# Altium project station_de_charge.PrjPcb
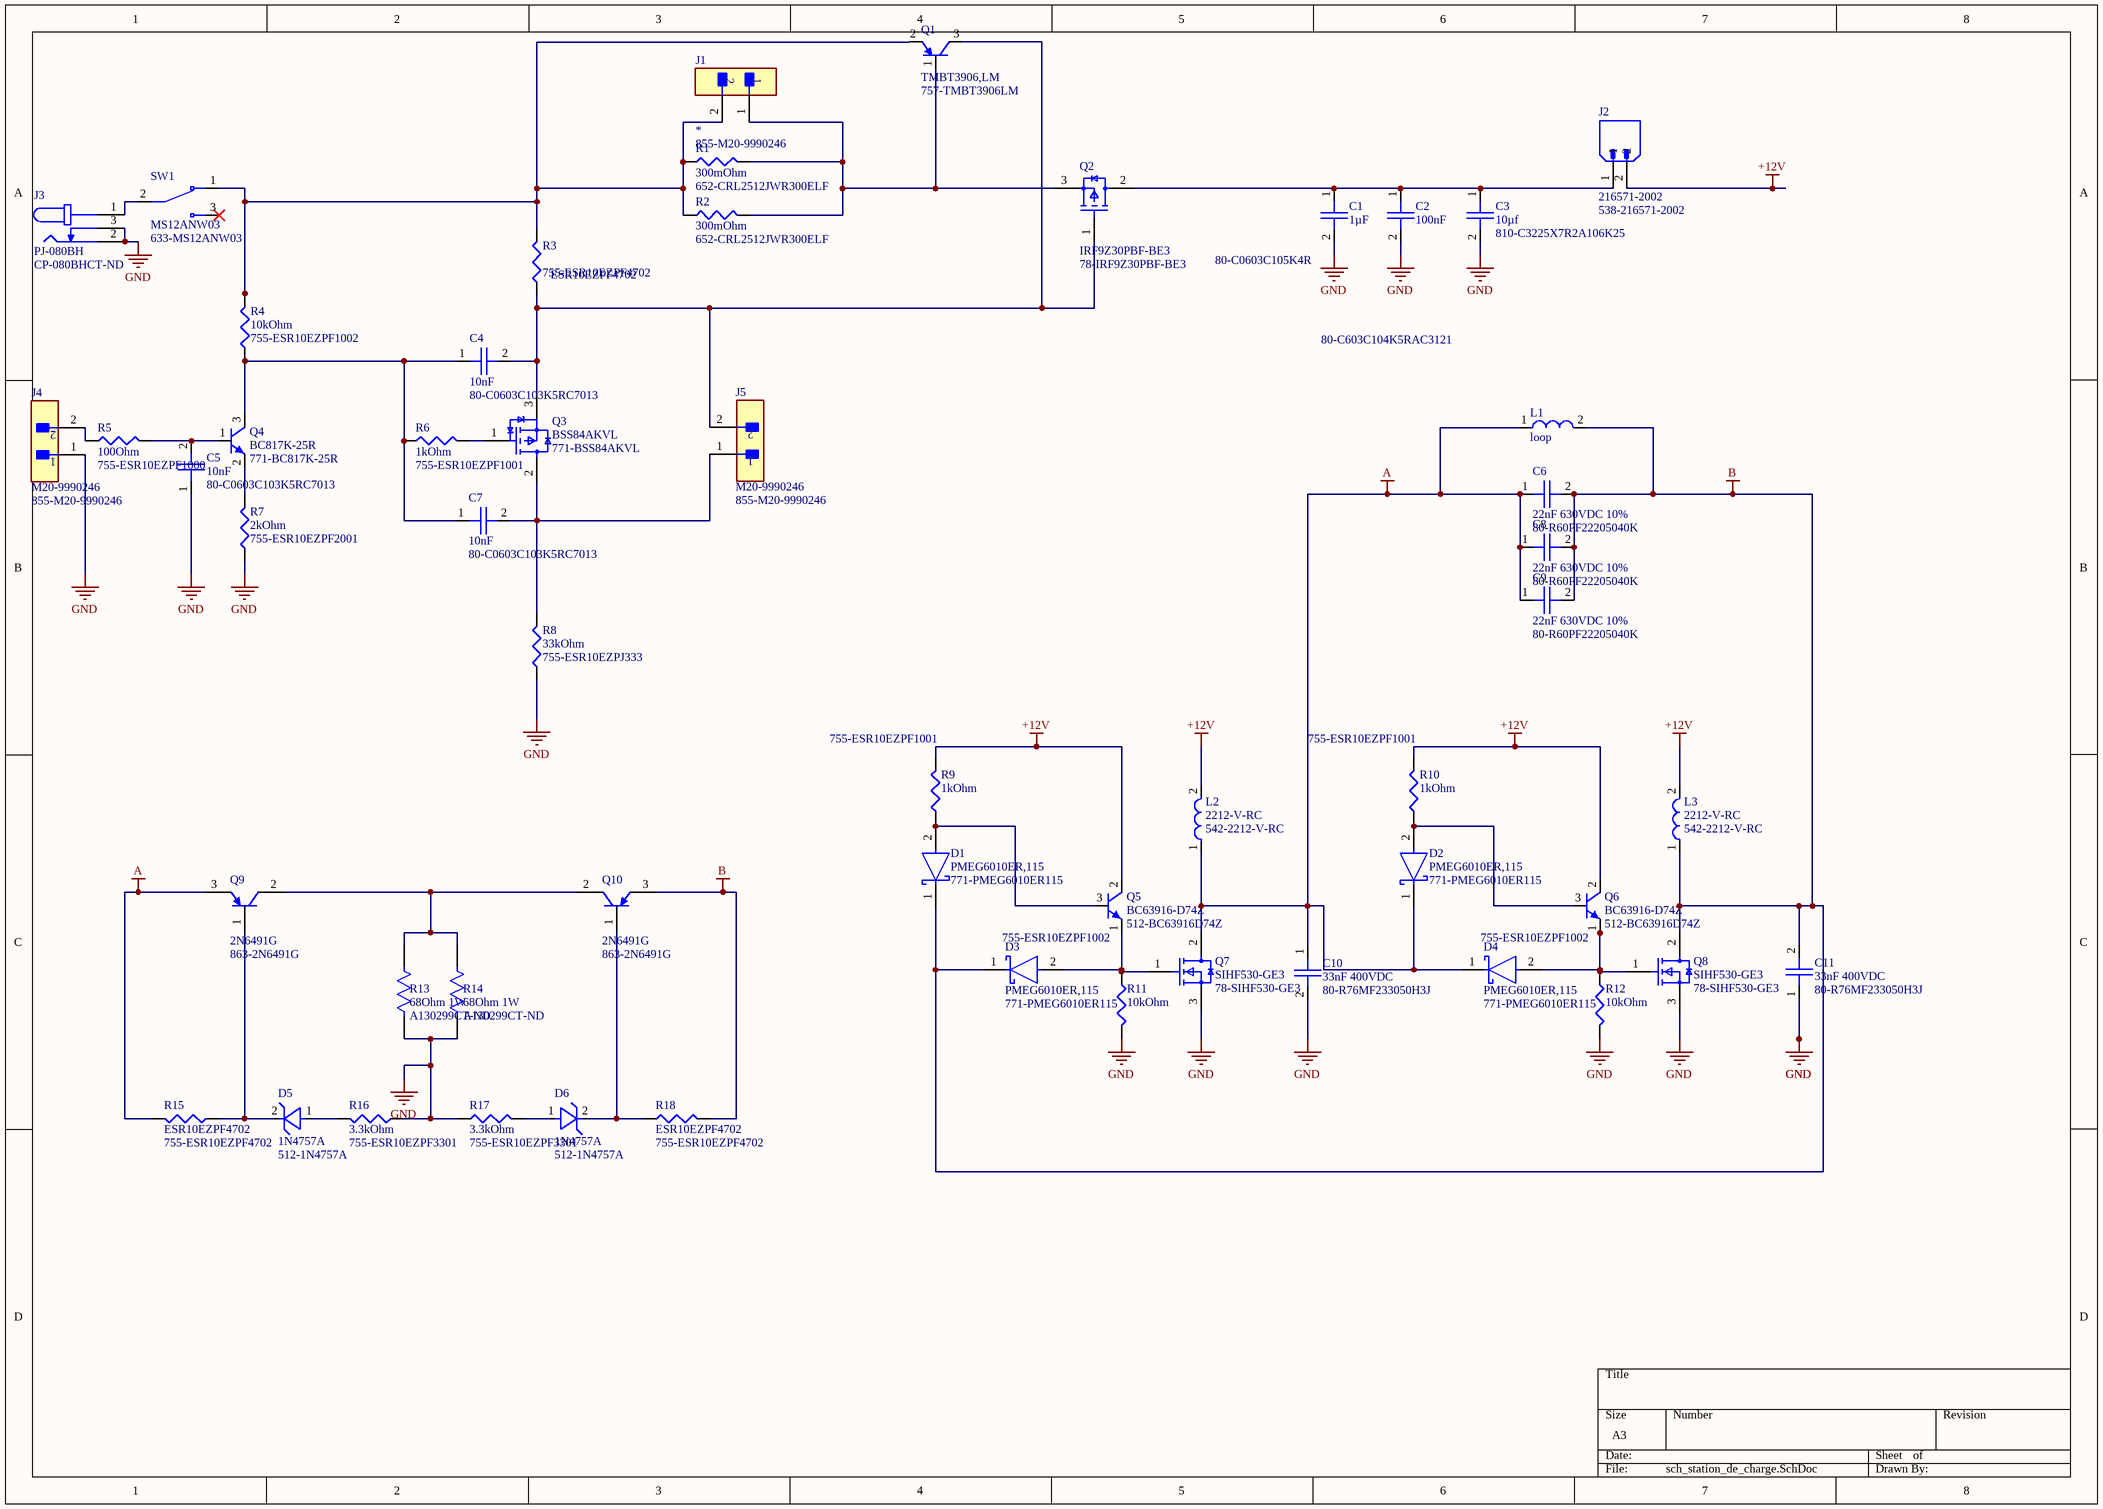
[diagram p0: sch_station_de_charge.SchDoc]
2 sheets, 65 parts. Net scope: global (net labels, ports and power ports of the same name join across sheets).
Board files: station_de_charge_PCB1.PcbDoc, station_de_charge_PCB1_r.PcbDoc
Sheets:
  sch_station_de_charge.SchDoc
  sch_station_de_charge_r.SchDoc

## Sheet sch_station_de_charge.SchDoc
size A3; SheetNumber: 1; SheetTotal: 2

### Parts
C1  1µF  Supplier Part Number 1: 80-C0603C105K4R  [CAPC1608X90X35NL15T15]
C2  100nF  Supplier Part Number 1: 80-C603C104K5RAC3121  [FP-C0603C104K5RAC3121-IPC_A]
C3  10µf  Supplier Part Number 1: 810-C3225X7R2A106K25  [CAPC3225X280N]
C4  10nF  Supplier Part Number 1: 80-C0603C103K5RC7013  [FP-C0603C104K5RAC3121-IPC_A]
C5  10nF  Supplier Part Number 1: 80-C0603C103K5RC7013  [FP-C0603C104K5RAC3121-IPC_A]
C6  22nF 630VDC 10%  Supplier Part Number 1: 80-R60PF22205040K  [R60PF22205040K]
C7  10nF  Supplier Part Number 1: 80-C0603C103K5RC7013  [FP-C0603C104K5RAC3121-IPC_A]
C8  22nF 630VDC 10%  Supplier Part Number 1: 80-R60PF22205040K  [R60PF22205040K]
C9  22nF 630VDC 10%  Supplier Part Number 1: 80-R60PF22205040K  [R60PF22205040K]
C10  33nF 400VDC  Supplier Part Number 1: 80-R76MF233050H3J  [R60PF22205040K]
C11  33nF 400VDC  Supplier Part Number 1: 80-R76MF233050H3J  [R60PF22205040K]
D1  PMEG6010ER,115  Supplier Part Number 1: 771-PMEG6010ER115  [TVS_PTVS13VS1UR,115]
D2  PMEG6010ER,115  Supplier Part Number 1: 771-PMEG6010ER115  [TVS_PTVS13VS1UR,115]
D3  PMEG6010ER,115  Supplier Part Number 1: 771-PMEG6010ER115  [TVS_PTVS13VS1UR,115]
D4  PMEG6010ER,115  Supplier Part Number 1: 771-PMEG6010ER115  [TVS_PTVS13VS1UR,115]
D5  1N4757A  Supplier Part Number 1: 512-1N4757A  [FAIR-DO-41-2_V]
D6  1N4757A  Supplier Part Number 1: 512-1N4757A  [FAIR-DO-41-2_V]
J1  *  Supplier Part Number 1: 855-M20-9990246  [FP-M20-9990246-MFG]
J2  216571-2002  Supplier Part Number 1: 538-216571-2002  [MOLEX_2165712002]
J3  PJ-080BH  Supplier Part Number 1: CP-080BHCT-ND  [CUI_PJ-080BH]
J4  M20-9990246  Supplier Part Number 1: 855-M20-9990246  [FP-M20-9990246-MFG]
J5  M20-9990246  Supplier Part Number 1: 855-M20-9990246  [FP-M20-9990246-MFG]
L1  loop  [loop]
L2  2212-V-RC  Supplier Part Number 1: 542-2212-V-RC  [IND_HCTI-220-5.8]
L3  2212-V-RC  Supplier Part Number 1: 542-2212-V-RC  [IND_HCTI-220-5.8]
Q1  TMBT3906,LM  Supplier Part Number 1: 757-TMBT3906LM  [FP-TMBT3906]
Q2  IRF9Z30PBF-BE3  Supplier Part Number 1: 78-IRF9Z30PBF-BE3  [TO-220AB-3-package]
Q3  BSS84AKVL  Supplier Part Number 1: 771-BSS84AKVL  [SOT95P230X110-3N]
Q4  BC817K-25R  Supplier Part Number 1: 771-BC817K-25R  [SOT95P230X110-3N]
Q5  BC63916-D74Z  Supplier Part Number 1: 512-BC63916D74Z  [TO92127P478H483-3]
Q6  BC63916-D74Z  Supplier Part Number 1: 512-BC63916D74Z  [TO92127P478H483-3]
Q7  SIHF530-GE3  Supplier Part Number 1: 78-SIHF530-GE3  [FP-SIHF530-GE3]
Q8  SIHF530-GE3  Supplier Part Number 1: 78-SIHF530-GE3  [FP-SIHF530-GE3]
Q9  2N6491G  Supplier Part Number 1: 863-2N6491G  [ONSC-TO-220-3-221A-09]
Q10  2N6491G  Supplier Part Number 1: 863-2N6491G  [ONSC-TO-220-3-221A-09]
R1  300mOhm  Supplier Part Number 1: 652-CRL2512JWR300ELF  [RESC6331X70N]
R2  300mOhm  Supplier Part Number 1: 652-CRL2512JWR300ELF  [RESC6331X70N]
R3  ESR10EZPF4702  Supplier Part Number 1: 755-ESR10EZPF4702  [FP-ESR10-IPC_A]
R4  10kOhm  Supplier Part Number 1: 755-ESR10EZPF1002  [FP-ESR10-IPC_A]
R5  100Ohm  Supplier Part Number 1: 755-ESR10EZPF1000  [FP-ESR10-IPC_A]
R6  1kOhm  Supplier Part Number 1: 755-ESR10EZPF1001  [FP-ESR10-IPC_A]
R7  2kOhm  Supplier Part Number 1: 755-ESR10EZPF2001  [FP-ESR10-IPC_A]
R8  33kOhm  Supplier Part Number 1: 755-ESR10EZPJ333  [FP-ESR10-IPC_A]
R9  1kOhm  Supplier Part Number 1: 755-ESR10EZPF1001  [FP-ESR10-IPC_A]
R10  1kOhm  Supplier Part Number 1: 755-ESR10EZPF1001  [FP-ESR10-IPC_A]
R11  10kOhm  Supplier Part Number 1: 755-ESR10EZPF1002  [FP-ESR10-IPC_A]
R12  10kOhm  Supplier Part Number 1: 755-ESR10EZPF1002  [FP-ESR10-IPC_A]
R13  68Ohm 1W  Supplier Part Number 1: A130299CT-ND  [FP-CRGCQ2512-IPC_A]
R14  68Ohm 1W  Supplier Part Number 1: A130299CT-ND  [FP-CRGCQ2512-IPC_A]
R15  ESR10EZPF4702  Supplier Part Number 1: 755-ESR10EZPF4702  [FP-ESR10-IPC_A]
R16  3.3kOhm  Supplier Part Number 1: 755-ESR10EZPF3301  [FP-ESR10-IPC_A]
R17  3.3kOhm  Supplier Part Number 1: 755-ESR10EZPF3301  [FP-ESR10-IPC_A]
R18  ESR10EZPF4702  Supplier Part Number 1: 755-ESR10EZPF4702  [FP-ESR10-IPC_A]
SW1  MS12ANW03  Supplier Part Number 1: 633-MS12ANW03  [SW_MS12ANW03]

### Nets
+12V: J2.2 L2.2 L3.2 Q5.2(C) Q6.2(C) R9.2 R10.2
A: C6.1 C8.1 C9.1 C10.1 D2.1(C) D4.1(C) L1.1 L2.1 Q7.2(DRAIN) Q9.3(E) R15.2
B: C6.2 C8.2 C9.2 C11.2 D1.1(C) D3.1(C) L1.2 L3.1 Q8.2(DRAIN) Q10.3(E) R18.2
GND: C1.2 C2.2 C3.2 C5.1 C10.2 C11.1 J3.2 J3.3 J4.1 Q7.3(SOURCE) Q8.3(SOURCE) R7.1 R8.1 R11.2 R12.2 R13.1 R14.1 R16.1 R17.1
NetC1_1: C1.1 C2.1 C3.1 J2.1 Q2.2(DRAIN)
NetC4_1: C4.1 C7.1 Q4.3(C) R4.1 R6.1
NetC4_2: C4.2 J5.2 Q1.3(C) Q2.1(GATE) Q3.3(SOURCE) R3.1
NetC5_2: C5.2 Q4.1(B) R5.2
NetC7_2: C7.2 J5.1 Q3.2(DRAIN) R8.2
NetD1_2: D1.2(A) Q5.3(B) R9.1
NetD2_2: D2.2(A) Q6.3(B) R10.1
NetD3_2: D3.2(A) Q5.1(E) Q7.1(GATE) R11.1
NetD4_2: D4.2(A) Q6.1(E) Q8.1(GATE) R12.1
NetD5_1: D5.1(A) R16.2
NetD5_2: D5.2(K) Q9.1(B) R15.1
NetD6_1: D6.1(A) R17.2
NetD6_2: D6.2(K) Q10.1(B) R18.1
NetJ1_1: J1.1 Q1.1(B) Q2.3(SOURCE) R1.2 R2.2
NetJ1_2: J1.2 Q1.2(E) R1.1 R2.1 R3.2 R4.2 SW1.1
NetJ3_1: J3.1 SW1.2
NetJ4_2: J4.2 R5.1
NetQ3_1: Q3.1(GATE) R6.2
NetQ4_2: Q4.2(E) R7.2
NetQ9_2: Q9.2(C) Q10.2(C) R13.2 R14.2

Not connected (* = marked no-connect by the designer): SW1 3*

### Library data of the parts
C1 = C0603C105K4RACTU: Cap Ceramic 1uF 16V X7R 10% SMD 0603 125°C Paper T/R; Manufacturer: KEMET; Dissipation Factor: 3.5%; Manufacturer Part Number: C0603C105K4RACTU; RoHS: Yes; Category: Ceramic Capacitors; Stock 1: 3280807; Pricing 1: 1=0,17000, 10=0,08000, 50=0,08000, 100=0,03600, 500=0,02600, 1000=0,02000, 2000=0,01900, 4000=0,01600, 8000=0,01400, 10000=0,01400 (USD); Mount: Surface Mount,PCB; Case/Package: 0603; Number of Pins: 2; Case Code (Metric): 1608; Case Code (Imperial): 0603; Contact Plating: Tin,Matte; Dielectric Material: Ceramic; Min Operating Temperature: -55°C; Max Operating Temperature: 125°C; Package Quantity: 4000; Capacitance: 1uF; Voltage Rating: 16V; Tolerance: 10%; Packaging: Tape and Reel; Voltage Rating (DC): 16V; Dielectric: X7R; Termination: SMD/SMT; Voltage: 16V; Series: C0603C; Construction: Flat; Length: 1.6mm; Width: 0.031inch; Height: 0.8mm; Thickness: 0.034inch; Depth: 0.8mm; Radiation Hardening: No; REACH SVHC: No SVHC; RoHS Compliant: Yes; ComponentLink1URL: https://datasheet.ciiva.com/7823/kem-c1002-x7r-smd-7823997.pdf?src-supplier=Element14; ComponentLink1Description: https://datasheet.ciiva.com/7823/kem-c1002-x7r-smd-7823997.pdf?src-supplier=Element14; ComponentLink2URL: https://datasheet.ciiva.com/22749/kem-c1002-x7r-smd-22749721.pdf?src-supplier=Element14; ComponentLink2Description: https://datasheet.ciiva.com/22749/kem-c1002-x7r-smd-22749721.pdf?src-supplier=Element14; ComponentLink3URL: https://datasheet.ciiva.com/5419/kem-c1002-x7r-smd-5419750.pdf?src-supplier=Mouser; ComponentLink3Description: https://datasheet.ciiva.com/5419/kem-c1002-x7r-smd-5419750.pdf?src-supplier=Mouser; ComponentLink4URL: https://datasheet.ciiva.com/18192/getdatasheetpartid-385479-18192732.pdf?src-supplier=Verical; ComponentLink4Description: https://datasheet.ciiva.com/18192/getdatasheetpartid-385479-18192732.pdf?src-supplier=Verical; Supplier 1: Mouser
C2 = C0603C104K5RAC3121: Cap Ceramic 0.1uF 50V X7R 10% Pad SMD 0603 125°C T/R; Manufacturer: KEMET; Manufacturer Part Number: C0603C104K5RAC3121; RoHS: Yes; Category: Ceramic Capacitors; Stock 1: 3306727; Pricing 1: 1=0,13000, 10=0,09200, 50=0,09200, 100=0,04300, 1000=0,02500, 10000=0,01900 (USD); Case/Package: 0603; RoHS Compliant: Yes; Supplier 1: Mouser
C3 = C3225X7R2A106K250AC: Multilayer Ceramic Chip Capacitors, Capacitance=10μF, LxWxT: 3.2x2.5x2.5mm; Manufacturer: TDK; Supplier 1: Mouser; Manufacturer Part Number: C3225X7R2A106K250AC; RoHS: No; Stock 1: 11549; Pricing 1: 1=1,50000, 10=1,19000, 50=1,19000, 100=0,89100, 1000=0,72000, 10000=0,72000 (USD)
C4 C5 C7 = C0603C103K5RAC7013: Cap Ceramic 0.01uF 50V X7R 10% Pad SMD 0603 125C T/R; Manufacturer: KEMET; Supplier 1: Mouser; Manufacturer Part Number: C0603C103K5RAC7013; RoHS: Yes; Category: Ceramic Capacitors; Stock 1: 21368; Pricing 1: 1=0,13000, 10=0,05100, 50=0,05100, 100=0,04300, 500=0,03000, 1000=0,02500, 2000=0,02300, 4000=0,02000, 10000=0,02000 (USD); Mount: Surface Mount; Case/Package: 0603; Dielectric Material: Ceramic; Min Operating Temperature: -55°C; Max Operating Temperature: 125°C; Dielectric: X7R; Capacitance: 10nF; Tolerance: 10%; Voltage Rating (DC): 50V; Packaging: Tape and Reel; Package Quantity: 4000; Voltage Rating: 50V; Length: 1.6mm; Width: 0.031inch; Height: 0.8mm; Depth: 0.8mm; Thickness: 0.035inch; Radiation Hardening: No; ComponentLink1URL: http://components.arrow.com/part/dataview/5297356S5600630N7429?src-supplier=Arrow+Electronics; ComponentLink1Description: http://components.arrow.com/part/dataview/5297356S5600630N7429?src-supplier=Arrow+Electronics; ComponentLink2URL: https://www.distrelec.biz/Web/Downloads/_t/ds/KEM_C1002_X7R_SMD_eng_tds.pdf?mime=application%2Fpdf&src-supplier=Distrelec; ComponentLink2Description: https://www.distrelec.biz/Web/Downloads/_t/ds/KEM_C1002_X7R_SMD_eng_tds.pdf?mime=application%2Fpdf&src-supplier=Distrelec; ComponentLink3URL: https://api.kemet.com/component-edge/download/datasheet/C0603C103K5RAC7013.pdf?src-supplier=Digi-Key; ComponentLink3Description: https://api.kemet.com/component-edge/download/datasheet/C0603C103K5RAC7013.pdf?src-supplier=Digi-Key
C6 C8 C9 = R60PF22205040K: Cap Film 0.022uF 630V PET 10%( 13 X 4 X 9mm) Radial Wound 10mm 105C Automotive Bag; Manufacturer: KEMET; Voltage Rating (AC): 220V; Supplier 1: Mouser; Manufacturer Part Number: R60PF22205040K; RoHS: Yes; Category: Film Capacitors; Stock 1: 1035; Pricing 1: 1=0,67000, 10=0,49600, 50=0,39700, 100=0,34000, 1000=0,22700, 10000=0,21200 (USD); Mount: Through Hole; Case/Package: Radial; Dielectric Material: PET; Min Operating Temperature: -55°C; Max Operating Temperature: 105°C; Capacitance: 22nF; Packaging: Bulk; Voltage Rating (DC): 630V; Dielectric: PET; Termination: PC Pins; Voltage Rating: 630V; Tolerance: 10%; Length: 0.512inch; Width: 0.157inch; Height - Seated (Max): 0.394inch; Lead Pitch: 0.394inch; REACH SVHC: No SVHC; RoHS Compliant: Yes; ComponentLink1URL: http://www.farnell.com/datasheets/1959821.pdf?src-supplier=Farnell; ComponentLink1Description: http://www.farnell.com/datasheets/1959821.pdf?src-supplier=Farnell; ComponentLink2URL: http://www.farnell.com/datasheets/1959821.pdf?src-supplier=Element14; ComponentLink2Description: http://www.farnell.com/datasheets/1959821.pdf?src-supplier=Element14; ComponentLink3URL: http://www.kemet.com/docfinder?Partnumber=R60&src-supplier=Digi-Key; ComponentLink3Description: http://www.kemet.com/docfinder?Partnumber=R60&src-supplier=Digi-Key
C10 C11 = R76MF233050H3J: Double Metallized Polypropylene Film Capacitor; Manufacturer: KEMET; Supplier 1: Mouser; Manufacturer Part Number: R76MF233050H3J; RoHS: Yes; Category: Film Capacitors; Stock 1: 1718; Pricing 1: 1=0,69000, 10=0,48900, 50=0,37000, 100=0,32200, 1000=0,20300, 10000=0,19000 (USD)
D1-D4 = PMEG6010ER,115: DIODE SCHOTTKY 60V 1A SOD123W; Manufacturer: Nexperia; Supplier 1: Mouser; Manufacturer Part Number: PMEG6010ER,115; RoHS: Yes; Category: Rectifier Diodes; Stock 1: 80739; Pricing 1: 1=0,44000, 10=0,33300, 50=0,33300, 100=0,20700, 500=0,14200, 1000=0,10900, 3000=0,09200, 9000=0,08400, 10000=0,08400, 24000=0,07800, 45000=0,07600 (USD); RoHS Compliant: Yes; ComponentLink1URL: http://www.farnell.com/datasheets/1383349.pdf?src-supplier=Farnell; ComponentLink1Description: http://www.farnell.com/datasheets/1383349.pdf?src-supplier=Farnell; ComponentLink2URL: https://assets.nexperia.com/documents/data-sheet/PMEG6010ER.pdf?src-supplier=Digi-Key; ComponentLink2Description: https://assets.nexperia.com/documents/data-sheet/PMEG6010ER.pdf?src-supplier=Digi-Key
D5 D6 = 1N4757A: Diode Zener Single 51V 5% 1000mW 2-Pin DO-41; Manufacturer: ON Semiconductor / Fairchild; Impedance: 95R; Max Reverse Leakage Current: 5uA; Power Dissipation: 1W; Zener Current: 5mA; Supplier 1: Mouser; Manufacturer Part Number: 1N4757A; RoHS: Yes; Category: Zener Diodes; Stock 1: 12862; Pricing 1: 1=0,35000, 10=0,28600, 50=0,28600, 100=0,15200, 500=0,10000, 1000=0,06800, 3000=0,05300, 9000=0,04500, 10000=0,04500, 24000=0,04200, 45000=0,03800 (USD); Mount: Through Hole; Case/Package: DO-41-2; Number of Pins: 2; Weight: 0.245g; Min Operating Temperature: -65°C; Max Operating Temperature: 200°C; Zener Voltage: 51V; Packaging: Bulk; Element Configuration: Single; Package Quantity: 1000; Voltage Tolerance: 5%; Max Power Dissipation: 1W; Test Current: 5mA; Tolerance: 5%; Power Rating: 1W; Voltage Rating (DC): 51V; Max Reverse Current: 5uA; Working Voltage: 51V; Radiation Hardening: No; RoHS Compliant: Yes; Lead Free: Lead Free; ComponentLink1URL: https://datasheet.ciiva.com/4732/1n4757a-188306-4732517.pdf?src-supplier=Mouser; ComponentLink1Description: https://datasheet.ciiva.com/4732/1n4757a-188306-4732517.pdf?src-supplier=Mouser; ComponentLink2URL: https://datasheet.ciiva.com/897/1n4731a-897602.pdf?src-supplier=Digi-Key; ComponentLink2Description: https://datasheet.ciiva.com/897/1n4731a-897602.pdf?src-supplier=Digi-Key; ComponentLink3URL: https://datasheet.ciiva.com/8346/1n4730a-8346458.pdf?src-supplier=Avnet; ComponentLink3Description: https://datasheet.ciiva.com/8346/1n4730a-8346458.pdf?src-supplier=Avnet; ComponentLink4URL: https://datasheet.ciiva.com/16818/1n4757a-16818154.pdf?src-supplier=Future+Electronics; ComponentLink4Description: https://datasheet.ciiva.com/16818/1n4757a-16818154.pdf?src-supplier=Future+Electronics
J1 J4 J5 = M20-9990246: 2.54mm (0.1") Pitch SIL Vertical PC Tail Pin Header, 6.1mm mating pin height, tin, 2 contacts; Manufacturer: Harwin; Number of Contacts: 2; Current Rating: 3A; Contact Resistance: 30mR; Gender: Male; Insulation Resistance: 10GR; Voltage Rating (AC): 750V; Connector Type: Male Pin; Supplier 1: Mouser; Manufacturer Part Number: M20-9990246; RoHS: Yes; Category: Headers and Wire Housings; Stock 1: 121083; Pricing 1: 1=0,17000, 10=0,08400, 50=0,08400, 100=0,07000, 500=0,06300, 1000=0,05400, 2000=0,04600, 10000=0,04500, 25000=0,03700, 50000=0,03500 (USD); Mount: Through Hole; Case/Package: SIL; Contact Plating: Tin; Color: Black; Contact Material: Brass,Bronze; Housing Color: Black; Housing Material: Nylon; Min Operating Temperature: -40°C; Max Operating Temperature: 105°C; Number of Rows: 1; Termination: Solder; Package Quantity: 1000; Packaging: Bulk; Max Current Rating: 3A; Number of Positions: 2; Orientation: Straight; Length: 5.08mm; Pitch: 2.54mm; Contact Mating Length: 0.24inch; Depth: 2.54mm; Radiation Hardening: No; REACH SVHC: No SVHC; ComponentLink1URL: https://datasheet.ciiva.com/8046/315376-8046930.pdf?src-supplier=Element14; ComponentLink1Description: https://datasheet.ciiva.com/8046/315376-8046930.pdf?src-supplier=Element14; ComponentLink2URL: https://datasheet.ciiva.com/11745/0900766b81034e61-11745755.pdf?src-supplier=RSComponents; ComponentLink2Description: https://datasheet.ciiva.com/11745/0900766b81034e61-11745755.pdf?src-supplier=RSComponents; ComponentLink3URL: https://datasheet.ciiva.com/22660/1830818-22660571.pdf?src-supplier=Element14; ComponentLink3Description: https://datasheet.ciiva.com/22660/1830818-22660571.pdf?src-supplier=Element14; ComponentLink4URL: https://datasheet.ciiva.com/6833/m20-999-6833368.pdf?src-supplier=Digi-Key; ComponentLink4Description: https://datasheet.ciiva.com/6833/m20-999-6833368.pdf?src-supplier=Digi-Key; ComponentLink5URL: https://datasheet.ciiva.com/26852/getdatasheetpartid-384170-26852203.pdf?src-supplier=Verical; ComponentLink5Description: https://datasheet.ciiva.com/26852/getdatasheetpartid-384170-26852203.pdf?src-supplier=Verical
J2 = 216571-2002: Connector Power Header 2Position 3mm PC Pin Straight Through Hole 2 Terminal 1 Port Tray; Manufacturer: Molex; Supplier 1: Mouser; Manufacturer Part Number: 216571-2002; RoHS: No; Stock 1: 4447; Pricing 1: 1=1,67000, 10=1,19000, 50=1,19000, 100=1,04000, 576=1,02000, 1000=1,02000, 1152=0,89300, 2592=0,87100, 5184=0,84000, 10000=0,84000, 10080=0,80200 (USD)
J3 = PJ-080BH: Power Barrel Connector Jack 2.50mm ID (0.098"), 5.50mm OD (0.217") Through Hole,; Manufacturer: CUI; Gender: Male; Shielding: Shielded; Current Rating: 10A; Number of Conductors: 2; Supplier 1: Digi-Key; Manufacturer Part Number: PJ-080BH; RoHS: Yes; Category: Connectors; Mount: Through Hole; Color: Black; Contact Material: Brass; Contact Plating: Silver; Housing Color: Black; Housing Material: Nylon; Min Operating Temperature: -25°C; Max Operating Temperature: 85°C; Termination: Solder; Packaging: Tape and Reel; Orientation: Horizontal; Connector Type: Jack; Series: -; Lead Free: Lead Free; RoHS Compliant: Yes; ComponentLink1URL: https://www.cui.com/product/resource/digikeypdf/pj-080bh.pdf?src-supplier=Digi-Key; ComponentLink1Description: https://www.cui.com/product/resource/digikeypdf/pj-080bh.pdf?src-supplier=Digi-Key
L2 L3 = 2212-V-RC: Inductor High Current Toroid 100uH/64uH 15% 1KHz 4.4A 56mOhm DCR RDL; Manufacturer: Bourns JW Miller; Core Material: Ferrite; Lead/Base Style: Radial; Inductance: 100uH; Shielding: Shielded; DC Resistance (DCR): 56mR; Lead Diameter: 0.86mm; Supplier 1: Mouser; Manufacturer Part Number: 2212-V-RC; RoHS: Yes; Category: Fixed Inductors; Stock 1: 1501; Pricing 1: 1=4,88000, 10=4,48000, 50=3,72000, 100=2,93000, 1000=2,93000, 10000=2,93000 (USD); Mount: Through Hole,Radial; Case/Package: Radial; Number of Pins: 2; Contact Plating: Tin; Min Operating Temperature: -55°C; Max Operating Temperature: 105°C; Tolerance: 15%; Test Frequency: 1kHz; Inductance Tolerance: 15%; Current Rating: 4.4A; Package Quantity: 77; Packaging: Bulk; Max DC Current: 4.4A; Termination: Radial; DC Current: 4.4A; RMS Current (Irms): 4.4A; Series: 2200; Diameter: 0.95inch; Width: 0.55inch; Lead Pitch: 11.176mm; Height - Seated (Max): 0.55inch; Depth: 13.97mm; Radiation Hardening: No; REACH SVHC: No SVHC; Military Standard: Not; Lead Free: Lead Free; RoHS Compliant: Yes; ComponentLink1URL: https://datasheet.ciiva.com/11798/0900766b80fa5688-11798051.pdf?src-supplier=RSComponents; ComponentLink1Description: https://datasheet.ciiva.com/11798/0900766b80fa5688-11798051.pdf?src-supplier=RSComponents; ComponentLink2URL: https://datasheet.ciiva.com/6690/2200-series-6690646.pdf?src-supplier=Digi-Key; ComponentLink2Description: https://datasheet.ciiva.com/6690/2200-series-6690646.pdf?src-supplier=Digi-Key; ComponentLink3URL: https://datasheet.ciiva.com/28654/2200-series-28654982.pdf?src-supplier=Element14; ComponentLink3Description: https://datasheet.ciiva.com/28654/2200-series-28654982.pdf?src-supplier=Element14; ComponentLink4URL: https://datasheet.ciiva.com/3076/2200-series-3076522.pdf?src-supplier=Avnet; ComponentLink4Description: https://datasheet.ciiva.com/3076/2200-series-3076522.pdf?src-supplier=Avnet
Q1 = TMBT3906,LM: TRANSPNP50V0.15ASOT23-3; Manufacturer: Toshiba; Max Collector Current: 150mA; Collector Emitter Voltage (VCEO): 400mV; Max Power Dissipation: 320mW; Transition Frequency: 250MHz; Collector Emitter Breakdown Voltage: 50V; Supplier 1: Mouser; Manufacturer Part Number: TMBT3906,LM; RoHS: Yes; Category: BJTs; Stock 1: 7851; Pricing 1: 1=0,18000, 10=0,16800, 50=0,16800, 100=0,09100, 500=0,05600, 1000=0,03900, 3000=0,02900, 9000=0,02500, 10000=0,02500, 24000=0,02200, 45000=0,01900 (USD); Mount: Surface Mount; Case/Package: TO-236-3; Packaging: Tape and Reel; Max Breakdown Voltage: 50V; ComponentLink1URL: http://www.mouser.com/ds/2/408/TMBT3906_datasheet_en_20150108-736658.pdf?src-supplier=Mouser; ComponentLink1Description: http://www.mouser.com/ds/2/408/TMBT3906_datasheet_en_20150108-736658.pdf?src-supplier=Mouser; ComponentLink2URL: https://toshiba.semicon-storage.com/info/docget.jsp?did=29746&prodName=TMBT3906&src-supplier=Digi-Key; ComponentLink2Description: https://toshiba.semicon-storage.com/info/docget.jsp?did=29746&prodName=TMBT3906&src-supplier=Digi-Key
Q2 = IRF9Z30PBF-BE3: Manufacturer: Vishay Siliconix; Supplier 1: Mouser; Manufacturer Part Number: IRF9Z30PBF-BE3; RoHS: No; Stock 1: 1837; Pricing 1: 1=2,94000, 10=2,65000, 25=2,50000, 50=2,50000, 100=2,13000, 500=1,75000, 1000=1,44000, 2000=1,40000, 10000=1,40000 (USD)
Q3 = BSS84AKVL: BSS84AKV/SOT666/SOT6; Manufacturer: Nexperia; Supplier 1: Mouser; Manufacturer Part Number: BSS84AKVL; RoHS: Yes; Stock 1: 4944; Pricing 1: 1=0,24000, 10=0,20200, 50=0,20200, 100=0,10800, 500=0,07100, 1000=0,04800, 2500=0,03800, 10000=0,03100 (USD); RoHS Compliant: Yes
Q4 = BC817K-25R: BC817K-25H/SOT23/TO-236AB; Manufacturer: Nexperia; Supplier 1: Mouser; Manufacturer Part Number: BC817K-25R; RoHS: No; Category: BJTs; Stock 1: 50401; Pricing 1: 1=0,24000, 10=0,19900, 50=0,19900, 100=0,10600, 1000=0,04800, 10000=0,03100 (USD); RoHS Compliant: Yes
Q5 Q6 = BC63916-D74Z: NPN Medium Power Transistor; Manufacturer: ON Semiconductor / Fairchild; Supplier 1: Mouser; Manufacturer Part Number: BC63916-D74Z; RoHS: Yes; Category: BJTs; Stock 1: 60363; Pricing 1: 1=0,37000, 10=0,30600, 50=0,30600, 100=0,20800, 1000=0,11700, 10000=0,09500 (USD); RoHS Compliant: Yes; ComponentLink1URL: https://www.onsemi.com/pub/Collateral/BC63916-D.PDF?src-supplier=Digi-Key; ComponentLink1Description: https://www.onsemi.com/pub/Collateral/BC63916-D.PDF?src-supplier=Digi-Key
Q7 Q8 = SIHF530-GE3: Manufacturer: Vishay; Supplier 1: Mouser; Manufacturer Part Number: SIHF530-GE3; RoHS: No; Stock 1: 547; Pricing 1: 1=0,97000, 10=0,85800, 50=0,85800, 100=0,65700, 1000=0,41600, 10000=0,36600 (USD)
Q9 Q10 = 2N6491G: Power Bipolar Transistor, 15A, 8; Manufacturer: ON Semiconductor; Frequency: 5MHz; Collector Emitter Voltage (VCEO): 80V; Max Power Dissipation: 1.8W; Number of Elements: 1; hFE Min: 20; Polarity: PNP; Collector Base Voltage (VCBO): 90V; Emitter Base Voltage (VEBO): 5V; Collector Emitter Saturation Voltage: 3.5V; Element Configuration: Single; Voltage Rating (DC): -80V; Supplier 1: Mouser; Manufacturer Part Number: 2N6491G; RoHS: Yes; Category: BJTs; Stock 1: 1110; Pricing 1: 1=1,12000, 10=1,01000, 50=0,95200, 100=0,95200, 1000=0,95200, 10000=0,95200 (USD); Case/Package: TO-220-3; Number of Pins: 3; Weight: 0.01lb; Contact Plating: Tin,Matte; Min Operating Temperature: -65°C; Max Operating Temperature: 150°C; Package Quantity: 50; Packaging: Rail/Tube; Max Collector Current: 15A; Transition Frequency: 5MHz; Power Dissipation: 1.8W; Collector Emitter Breakdown Voltage: 80V; Max Frequency: 5MHz; Gain Bandwidth Product: 5MHz; Current Rating: 15A; Series: -; Collector-emitter Voltage-Max: 3.5V; Length: 10.28mm; Width: 4.82mm; Height: 15.75mm; Radiation Hardening: No; REACH SVHC: No SVHC; Lead Free: Lead Free; RoHS Compliant: Yes; ComponentLink1URL: https://datasheet.ciiva.com/15138/getdatasheetpartid-42144-15138735.pdf?src-supplier=Verical; ComponentLink1Description: https://datasheet.ciiva.com/15138/getdatasheetpartid-42144-15138735.pdf?src-supplier=Verical; ComponentLink2URL: https://datasheet.ciiva.com/978/2n6487-d-978689.pdf?src-supplier=Digi-Key; ComponentLink2Description: https://datasheet.ciiva.com/978/2n6487-d-978689.pdf?src-supplier=Digi-Key; ComponentLink3URL: https://datasheet.ciiva.com/1260/2n6487-d-1260672.pdf?src-supplier=Newark; ComponentLink3Description: https://datasheet.ciiva.com/1260/2n6487-d-1260672.pdf?src-supplier=Newark; ComponentLink4URL: https://datasheet.ciiva.com/30480/0900766b8126cbeb-30480658.pdf?src-supplier=RSComponents; ComponentLink4Description: https://datasheet.ciiva.com/30480/0900766b8126cbeb-30480658.pdf?src-supplier=RSComponents; ComponentLink5URL: https://datasheet.ciiva.com/1215/79212-1215972.pdf?src-supplier=Farnell; ComponentLink5Description: https://datasheet.ciiva.com/1215/79212-1215972.pdf?src-supplier=Farnell; ComponentLink6URL: https://datasheet.ciiva.com/3303/2n6487-d-3303896.pdf?src-supplier=Avnet; ComponentLink6Description: https://datasheet.ciiva.com/3303/2n6487-d-3303896.pdf?src-supplier=Avnet
R1 R2 = CRL2512-JW-R300ELF: Res Thick Film 2512 0.3 Ohm 5% 1W ±200ppm/°C Molded SMD SMD Embossed Plastic T/R; Manufacturer: Bourns; Resistance: 300mR; Supplier 1: Mouser; Manufacturer Part Number: CRL2512-JW-R300ELF; RoHS: Yes; Category: Chip SMD Resistors; Stock 1: 2644; Pricing 1: 1=0,69000, 10=0,51000, 50=0,51000, 100=0,29700, 1000=0,16700, 10000=0,15600 (USD); ComponentLink1URL: https://datasheet.ciiva.com/9120/crl-9120009.pdf?src-supplier=Avnet; ComponentLink1Description: https://datasheet.ciiva.com/9120/crl-9120009.pdf?src-supplier=Avnet; Mount: Surface Mount; Case/Package: 2512; Case Code (Imperial): 2512; Case Code (Metric): 6432; Contact Plating: Tin; Min Operating Temperature: -55°C; Max Operating Temperature: 125°C; Packaging: Tape and Reel; Power Rating: 1W; Tolerance: 5%; Package Quantity: 4000; Resistor Type: Thick Film; Termination: SMD/SMT; Number of Terminations: 2; Temperature Coefficient: 200ppm/°C; Max Power Dissipation: 1W; Series: CRL; Length: 0.248inch; Width: 3.1mm; Height: 0.028inch; Radiation Hardening: No; RoHS Compliant: Yes
R3 R15 R18 = ESR10EZPF4702: Res Thick Film 0805 47K Ohm 1% 0.4W ±100ppm/C Pad SMD Automotive T/R; Manufacturer: Rohm; Resistance: 47kR; Temperature Coefficient: 100ppm/°C; Max Power Dissipation: 400mW; Supplier 1: Mouser; Manufacturer Part Number: ESR10EZPF4702; RoHS: Yes; Category: Chip SMD Resistors; Stock 1: 31570; Pricing 1: 1=0,18000, 10=0,15300, 50=0,15300, 100=0,06000, 1000=0,02600, 2500=0,02300, 5000=0,02000, 10000=0,02000 (USD); Case/Package: 0805; Case Code (Metric): 2012; Case Code (Imperial): 0805; Min Operating Temperature: -55°C; Max Operating Temperature: 155°C; Tolerance: 1%; Packaging: Tape and Reel; Resistor Type: Thick Film; Package Quantity: 1; Number of Terminations: 2; Features: Automotive AEC-Q200; Series: ESR; Length: 0.079inch; Width: 0.049inch; Height: 0.026inch; RoHS Compliant: Yes; ComponentLink1URL: https://datasheet.ciiva.com/2469/esr-2469981.pdf?src-supplier=Digi-Key; ComponentLink1Description: https://datasheet.ciiva.com/2469/esr-2469981.pdf?src-supplier=Digi-Key; ComponentLink2URL: https://datasheet.ciiva.com/2469/esr-2469979.pdf?src-supplier=Digi-Key; ComponentLink2Description: https://datasheet.ciiva.com/2469/esr-2469979.pdf?src-supplier=Digi-Key; ComponentLink3URL: https://datasheet.ciiva.com/2469/esr-2469980.pdf?src-supplier=Digi-Key; ComponentLink3Description: https://datasheet.ciiva.com/2469/esr-2469980.pdf?src-supplier=Digi-Key
R4 R11 R12 = ESR10EZPF1002: Res Thick Film 0805 10K Ohm 1% 0.4W ±100ppm/C Pad SMD Automotive T/R; Manufacturer: Rohm; Resistance: 10kR; Max Power Dissipation: 400mW; Temperature Coefficient: 100ppm/°C; Manufacturer Part Number: ESR10EZPF1002; RoHS: Yes; Category: Chip SMD Resistors; Stock 1: 82018; Pricing 1: 1=0,18000, 10=0,15300, 50=0,15300, 100=0,06000, 1000=0,02600, 2500=0,02300, 5000=0,02000, 10000=0,02000 (USD); Case/Package: 0805; Case Code (Metric): 2012; Case Code (Imperial): 0805; Min Operating Temperature: -55°C; Max Operating Temperature: 155°C; Package Quantity: 1; Tolerance: 1%; Packaging: Tape and Reel; Resistor Type: Thick Film; Number of Terminations: 2; Features: Automotive AEC-Q200; Series: ESR; Length: 0.079inch; Width: 0.049inch; Height: 0.026inch; RoHS Compliant: Yes; ComponentLink1URL: https://datasheet.ciiva.com/2469/esr-2469862.pdf?src-supplier=Digi-Key; ComponentLink1Description: https://datasheet.ciiva.com/2469/esr-2469862.pdf?src-supplier=Digi-Key; ComponentLink2URL: https://datasheet.ciiva.com/2469/esr-2469863.pdf?src-supplier=Digi-Key; ComponentLink2Description: https://datasheet.ciiva.com/2469/esr-2469863.pdf?src-supplier=Digi-Key; ComponentLink3URL: https://datasheet.ciiva.com/2469/esr-2469864.pdf?src-supplier=Digi-Key; ComponentLink3Description: https://datasheet.ciiva.com/2469/esr-2469864.pdf?src-supplier=Digi-Key; Supplier 1: Mouser
R5 = ESR10EZPF1000: Res Thick Film 0805 100 Ohm 1% 2/5W ±100ppm/°C Molded SMD Paper T/R; Manufacturer: Rohm; Resistance: 100R; Max Power Dissipation: 400mW; Manufacturer Part Number: ESR10EZPF1000; RoHS: Yes; Category: Chip SMD Resistors; Stock 1: 17116; Pricing 1: 1=0,18000, 10=0,15300, 50=0,15300, 100=0,06000, 1000=0,02600, 10000=0,02000 (USD); Case/Package: 0805; Case Code (Imperial): 0805; Case Code (Metric): 2012; Min Operating Temperature: -55°C; Max Operating Temperature: 155°C; Resistor Type: Thick Film; Packaging: Tape and Reel; Tolerance: 1%; Temperature Coefficient: 100ppm/°C; Features: Automotive AEC-Q200; Number of Terminations: 2; Series: ESR; RoHS Compliant: Yes; ComponentLink1URL: http://www.farnell.com/datasheets/2611941.pdf?src-supplier=Farnell; ComponentLink1Description: http://www.farnell.com/datasheets/2611941.pdf?src-supplier=Farnell; ComponentLink2URL: https://www.rohm.com/datasheet/ESR01MZPF/esr-e?src-supplier=Digi-Key; ComponentLink2Description: https://www.rohm.com/datasheet/ESR01MZPF/esr-e?src-supplier=Digi-Key; ComponentLink3URL: http://www.farnell.com/datasheets/2611941.pdf?src-supplier=Newark; ComponentLink3Description: http://www.farnell.com/datasheets/2611941.pdf?src-supplier=Newark; ComponentLink4URL: http://rohmfs.rohm.com/en/products/databook/datasheet/passive/resistor/chip_resistor/esr.pdf?src-supplier=Avnet; ComponentLink4Description: http://rohmfs.rohm.com/en/products/databook/datasheet/passive/resistor/chip_resistor/esr.pdf?src-supplier=Avnet; Supplier 1: Mouser
R6 R9 R10 = ESR10EZPF1001: Res Thick Film 0805 1K Ohm 1% 0.4W ±100ppm/C Epoxy Resin Pad SMD Automotive T/R; Manufacturer: Rohm; Resistance: 1kR; Temperature Coefficient: 100ppm/°C; Power Rating: 400mW; Manufacturer Part Number: ESR10EZPF1001; RoHS: Yes; Category: Chip SMD Resistors; Stock 1: 27313; Pricing 1: 1=0,18000, 10=0,15300, 50=0,15300, 100=0,06000, 1000=0,02600, 10000=0,02000 (USD); Case/Package: 0805; Case Code (Metric): 2012; Case Code (Imperial): 0805; Size Code: 0805; Min Operating Temperature: -55°C; Max Operating Temperature: 155°C; Tolerance: 1%; Packaging: Tape and Reel; Resistor Type: Thick Film; Package Quantity: 1; Number of Terminations: 2; Max Power Dissipation: 400mW; Features: Automotive AEC-Q200; Series: ESR; Length: 0.079inch; Width: 0.049inch; Height: 0.026inch; Lead Free: Lead Free; RoHS Compliant: Yes; ComponentLink1URL: https://datasheet.ciiva.com/2470/esr-2470004.pdf?src-supplier=Digi-Key; ComponentLink1Description: https://datasheet.ciiva.com/2470/esr-2470004.pdf?src-supplier=Digi-Key; ComponentLink2URL: https://datasheet.ciiva.com/2470/esr-2470005.pdf?src-supplier=Digi-Key; ComponentLink2Description: https://datasheet.ciiva.com/2470/esr-2470005.pdf?src-supplier=Digi-Key; ComponentLink3URL: https://datasheet.ciiva.com/2470/esr-2470003.pdf?src-supplier=Digi-Key; ComponentLink3Description: https://datasheet.ciiva.com/2470/esr-2470003.pdf?src-supplier=Digi-Key; Supplier 1: Mouser
R7 = ESR10EZPF2001: Res Thick Film 0805 2K Ohm 1% 2/5W ±100ppm/°C Molded SMD Paper T/R; Manufacturer: Rohm; Resistance: 2kR; Power Rating: 400mW; Supplier 1: Mouser; Manufacturer Part Number: ESR10EZPF2001; RoHS: Yes; Category: Chip SMD Resistors; Stock 1: 82201; Pricing 1: 1=0,18000, 10=0,15300, 50=0,15300, 100=0,06000, 1000=0,02600, 10000=0,02000 (USD); Case/Package: 0805; Case Code (Metric): 2012; Case Code (Imperial): 0805; Size Code: 0805; Tolerance: 1%; Packaging: Tape and Reel; Resistor Type: Thick Film; Temperature Coefficient: 100ppm/°C; Package Quantity: 5000; Number of Terminations: 2; Max Power Dissipation: 400mW; Series: ESR10; Length: 0.079inch; Width: 0.049inch; Height: 0.026inch; Lead Free: Lead Free; RoHS Compliant: Yes; ComponentLink1URL: http://www1.futureelectronics.com/doc/ROHM%20SEMICONDUCTOR/ESR10EZPD.pdf?src-supplier=Future+Electronics; ComponentLink1Description: http://www1.futureelectronics.com/doc/ROHM%20SEMICONDUCTOR/ESR10EZPD.pdf?src-supplier=Future+Electronics; ComponentLink2URL: https://www.rohm.com/datasheet/ESR01MZPF/esr-e?src-supplier=Digi-Key; ComponentLink2Description: https://www.rohm.com/datasheet/ESR01MZPF/esr-e?src-supplier=Digi-Key; ComponentLink3URL: http://www.rohm.com/web/global/datasheet/ESR01MZPF/esr-e?src-supplier=Digi-Key; ComponentLink3Description: http://www.rohm.com/web/global/datasheet/ESR01MZPF/esr-e?src-supplier=Digi-Key; ComponentLink4URL: http://rohmfs.rohm.com/en/products/databook/datasheet/passive/resistor/chip_resistor/esr.pdf?src-supplier=Avnet; ComponentLink4Description: http://rohmfs.rohm.com/en/products/databook/datasheet/passive/resistor/chip_resistor/esr.pdf?src-supplier=Avnet
R8 = ESR10EZPJ333: Res Thick Film 0805 33K Ohm 5% 0.4W ±200ppm/C Pad SMD Automotive T/R; Manufacturer: Rohm; Resistance: 33kR; Max Power Dissipation: 400mW; Temperature Coefficient: 200ppm/°C; Manufacturer Part Number: ESR10EZPJ333; RoHS: Yes; Category: Chip SMD Resistors; Stock 1: 12165; Pricing 1: 1=0,10000, 10=0,08600, 50=0,08600, 100=0,03300, 1000=0,01500, 10000=0,01100 (USD); Case/Package: 0805; Case Code (Metric): 2012; Case Code (Imperial): 0805; Min Operating Temperature: -55°C; Max Operating Temperature: 155°C; Package Quantity: 1; Tolerance: 5%; Packaging: Tape and Reel; Resistor Type: Thick Film; Number of Terminations: 2; Features: Automotive AEC-Q200; Series: ESR; Length: 0.079inch; Width: 0.049inch; Height: 0.026inch; RoHS Compliant: Yes; ComponentLink1URL: https://datasheet.ciiva.com/2495/esr-2495380.pdf?src-supplier=Digi-Key; ComponentLink1Description: https://datasheet.ciiva.com/2495/esr-2495380.pdf?src-supplier=Digi-Key; ComponentLink2URL: https://datasheet.ciiva.com/2495/esr-2495381.pdf?src-supplier=Digi-Key; ComponentLink2Description: https://datasheet.ciiva.com/2495/esr-2495381.pdf?src-supplier=Digi-Key; ComponentLink3URL: https://datasheet.ciiva.com/2495/esr-2495382.pdf?src-supplier=Digi-Key; ComponentLink3Description: https://datasheet.ciiva.com/2495/esr-2495382.pdf?src-supplier=Digi-Key; Supplier 1: Mouser
R13 R14 = CRGCQ2512J68R: Res General Purpose Thick Film 2512 68 Ohm 5% 1W ±200ppm/°C Molded Emboss T/R; Manufacturer: TE Connectivity; Supplier 1: Digi-Key; Manufacturer Part Number: CRGCQ2512J68R; RoHS: Yes; Category: Chip SMD Resistors; Stock 1: 165536; Pricing 1: 1=0,44000, 10=0,32000, 100=0,12780, 1000=0,06299 (USD)
R16 R17 = ESR10EZPF3301: Res Thick Film 0805 3.3K Ohm 1% 2/5W ±100ppm/°C Molded SMD SMD Paper T/R; Manufacturer: Rohm; Resistance: 3.3kR; Power Rating: 400mW; Supplier 1: Mouser; Manufacturer Part Number: ESR10EZPF3301; RoHS: Yes; Category: Chip SMD Resistors; Stock 1: 98; Pricing 1: 1=0,18000, 10=0,15300, 50=0,15300, 100=0,06000, 1000=0,02600, 10000=0,02000 (USD); Case/Package: 0805; Case Code (Imperial): 0805; Case Code (Metric): 2012; Size Code: 0805; Min Operating Temperature: -55°C; Max Operating Temperature: 155°C; Tolerance: 1%; Temperature Coefficient: 100ppm/°C; Packaging: Tape and Reel; Features: Automotive AEC-Q200; Series: ESR; Max Power Dissipation: 400mW; Number of Terminations: 2; Lead Free: Lead Free; RoHS Compliant: Yes; ComponentLink1URL: https://datasheet.ciiva.com/16439/esr-16439974.pdf?src-supplier=Future+Electronics; ComponentLink1Description: https://datasheet.ciiva.com/16439/esr-16439974.pdf?src-supplier=Future+Electronics
SW1 = MS12ANW03: Switch Slide ON None ON SPDT Top Slide 6A 250VAC 100000Cycles PC Pins Thru-Hole; Manufacturer: NKK Switches; Supplier 1: Mouser; Manufacturer Part Number: MS12ANW03; RoHS: Yes; Category: Slide Switches; Stock 1: 3041; Pricing 1: 1=3,96000, 10=3,72000, 25=3,51000, 50=3,42000, 100=3,37000, 250=3,33000, 500=2,74000, 1000=2,56000, 2500=2,39000, 10000=2,39000 (USD); ComponentLink1URL: https://datasheet.ciiva.com/24170/msnonilluminated-24170278.pdf?src-supplier=Future+Electronics; ComponentLink1Description: https://datasheet.ciiva.com/24170/msnonilluminated-24170278.pdf?src-supplier=Future+Electronics; ComponentLink2URL: https://datasheet.ciiva.com/15184/getdatasheetpartid-330062-15184172.pdf?src-supplier=Verical; ComponentLink2Description: https://datasheet.ciiva.com/15184/getdatasheetpartid-330062-15184172.pdf?src-supplier=Verical; ComponentLink3URL: https://datasheet.ciiva.com/2889/msnonilluminated-2889265.pdf?src-supplier=Digi-Key; ComponentLink3Description: https://datasheet.ciiva.com/2889/msnonilluminated-2889265.pdf?src-supplier=Digi-Key

## Sheet sch_station_de_charge_r.SchDoc
size A3; SheetNumber: 2; SheetTotal: 2
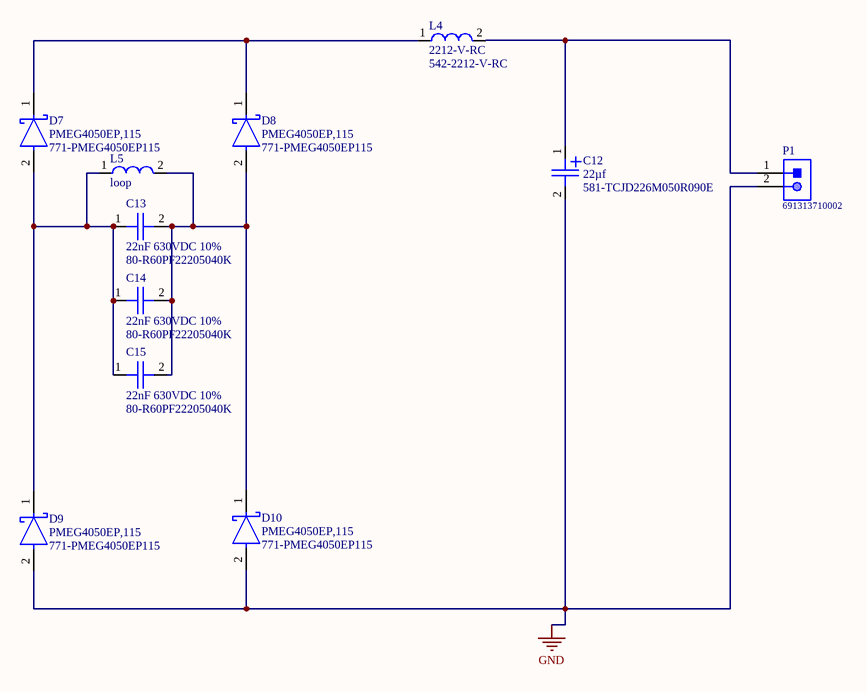
[diagram p1: sch_station_de_charge_r.SchDoc]

### Parts
C12  22µf  Supplier Part Number 1: 581-TCJD226M050R090E  [CAPPM7343X310N]
C13  22nF 630VDC 10%  Supplier Part Number 1: 80-R60PF22205040K  [R60PF22205040K]
C14  22nF 630VDC 10%  Supplier Part Number 1: 80-R60PF22205040K  [R60PF22205040K]
C15  22nF 630VDC 10%  Supplier Part Number 1: 80-R60PF22205040K  [R60PF22205040K]
D7  PMEG4050EP,115  Supplier Part Number 1: 771-PMEG4050EP115  [FP-SOD128-MFG]
D8  PMEG4050EP,115  Supplier Part Number 1: 771-PMEG4050EP115  [FP-SOD128-MFG]
D9  PMEG4050EP,115  Supplier Part Number 1: 771-PMEG4050EP115  [FP-SOD128-MFG]
D10  PMEG4050EP,115  Supplier Part Number 1: 771-PMEG4050EP115  [FP-SOD128-MFG]
L4  2212-V-RC  Supplier Part Number 1: 542-2212-V-RC  [IND_HCTI-220-5.8]
L5  loop  [loop]
P1  691313710002  [691313710002]

### Nets
GND: C12.2 D9.2(A) D10.2(A) P1.2
NetC12_1: C12.1 L4.2 P1.1
NetC13_1: C13.1 C14.1 C15.1 D7.2(A) D9.1(K) L5.1
NetC13_2: C13.2 C14.2 C15.2 D8.2(A) D10.1(K) L5.2
NetD7_1: D7.1(K) D8.1(K) L4.1

### Library data of the parts
C12 = TCJD226M050R0090E: Cap Tant Polymer 22uF 50VDC D CASE 20% (7.3 X 4.3 X 2.9mm) SMD 7343-31 0.09 Ohm 125C Automotive T/R; Manufacturer: Kyocera AVX; Manufacturer Part Number: TCJD226M050R0090E; RoHS: Yes; Stock 1: 3975; Pricing 1: 1=3,75000, 10=3,03000, 50=2,65000, 100=2,32000, 500=2,03000, 1000=2,03000, 10000=2,03000 (USD); Supplier 1: Mouser
C13-C15 = R60PF22205040K: as C6 on sheet sch_station_de_charge; Supplier 1: Mouser; Manufacturer Part Number: R60PF22205040K; RoHS: Yes; Category: Film Capacitors; Stock 1: 1035; Pricing 1: 1=0,67000, 10=0,49600, 50=0,39700, 100=0,34000, 1000=0,22700, 10000=0,21200 (USD); Mount: Through Hole; Case/Package: Radial; Dielectric Material: PET; Min Operating Temperature: -55°C; Max Operating Temperature: 105°C; Capacitance: 22nF; Packaging: Bulk; Voltage Rating (DC): 630V; Dielectric: PET; Termination: PC Pins; Voltage Rating: 630V; Tolerance: 10%; Length: 0.512inch; Width: 0.157inch; Height - Seated (Max): 0.394inch; Lead Pitch: 0.394inch; REACH SVHC: No SVHC; RoHS Compliant: Yes; ComponentLink1URL: http://www.farnell.com/datasheets/1959821.pdf?src-supplier=Farnell; ComponentLink1Description: http://www.farnell.com/datasheets/1959821.pdf?src-supplier=Farnell; ComponentLink2URL: http://www.farnell.com/datasheets/1959821.pdf?src-supplier=Element14; ComponentLink2Description: http://www.farnell.com/datasheets/1959821.pdf?src-supplier=Element14; ComponentLink3URL: http://www.kemet.com/docfinder?Partnumber=R60&src-supplier=Digi-Key; ComponentLink3Description: http://www.kemet.com/docfinder?Partnumber=R60&src-supplier=Digi-Key
D7-D10 = PMEG4050EP,115: DIODE SCHOTTKY 40V 5A SOD128; Manufacturer: Nexperia; Supplier 1: Mouser; Manufacturer Part Number: PMEG4050EP,115; RoHS: Yes; Category: Rectifier Diodes; Stock 1: 216619; Pricing 1: 1=0,55000, 10=0,47100, 50=0,47100, 100=0,35200, 1000=0,21400, 10000=0,17700 (USD); RoHS Compliant: Yes; ComponentLink1URL: http://www.farnell.com/datasheets/609330.pdf?src-supplier=Farnell; ComponentLink1Description: http://www.farnell.com/datasheets/609330.pdf?src-supplier=Farnell; ComponentLink2URL: http://www.farnell.com/datasheets/609330.pdf?src-supplier=Element14; ComponentLink2Description: http://www.farnell.com/datasheets/609330.pdf?src-supplier=Element14; ComponentLink3URL: https://www.mouser.com/ds/2/302/PMEG4050EP-1151641.pdf?src-supplier=Mouser; ComponentLink3Description: https://www.mouser.com/ds/2/302/PMEG4050EP-1151641.pdf?src-supplier=Mouser; ComponentLink4URL: http://www.farnell.com/datasheets/609330.pdf?src-supplier=Newark; ComponentLink4Description: http://www.farnell.com/datasheets/609330.pdf?src-supplier=Newark; ComponentLink5URL: https://assets.nexperia.com/documents/data-sheet/PMEG4050EP.pdf?src-supplier=Digi-Key; ComponentLink5Description: https://assets.nexperia.com/documents/data-sheet/PMEG4050EP.pdf?src-supplier=Digi-Key
L4 = 2212-V-RC: as L2 on sheet sch_station_de_charge; Supplier 1: Mouser; Manufacturer Part Number: 2212-V-RC; RoHS: Yes; Category: Fixed Inductors; Stock 1: 1501; Pricing 1: 1=4,88000, 10=4,48000, 50=3,72000, 100=2,93000, 1000=2,93000, 10000=2,93000 (USD); Mount: Through Hole,Radial; Case/Package: Radial; Number of Pins: 2; Contact Plating: Tin; Min Operating Temperature: -55°C; Max Operating Temperature: 105°C; Tolerance: 15%; Test Frequency: 1kHz; Inductance Tolerance: 15%; Current Rating: 4.4A; Package Quantity: 77; Packaging: Bulk; Max DC Current: 4.4A; Termination: Radial; DC Current: 4.4A; RMS Current (Irms): 4.4A; Series: 2200; Diameter: 0.95inch; Width: 0.55inch; Lead Pitch: 11.176mm; Height - Seated (Max): 0.55inch; Depth: 13.97mm; Radiation Hardening: No; REACH SVHC: No SVHC; Military Standard: Not; Lead Free: Lead Free; RoHS Compliant: Yes; ComponentLink1URL: https://datasheet.ciiva.com/11798/0900766b80fa5688-11798051.pdf?src-supplier=RSComponents; ComponentLink1Description: https://datasheet.ciiva.com/11798/0900766b80fa5688-11798051.pdf?src-supplier=RSComponents; ComponentLink2URL: https://datasheet.ciiva.com/6690/2200-series-6690646.pdf?src-supplier=Digi-Key; ComponentLink2Description: https://datasheet.ciiva.com/6690/2200-series-6690646.pdf?src-supplier=Digi-Key; ComponentLink3URL: https://datasheet.ciiva.com/28654/2200-series-28654982.pdf?src-supplier=Element14; ComponentLink3Description: https://datasheet.ciiva.com/28654/2200-series-28654982.pdf?src-supplier=Element14; ComponentLink4URL: https://datasheet.ciiva.com/3076/2200-series-3076522.pdf?src-supplier=Avnet; ComponentLink4Description: https://datasheet.ciiva.com/3076/2200-series-3076522.pdf?src-supplier=Avnet
P1 = CMP-1502-02048-1: Serie 3137 - 5.00mm Close Horizontal PCB Header WR-TBL, 2 pin; Manufacturer: Wurth Elektronik; Gender: Male; Pin Number: 2; Operating Temperature: -40to105degC; Manufacturer URL: http://www.we-online.de; Mounting Technology: THT; Package Reference: 691313710002; Part Number: 691313710002; Publisher: WurthElektronik; Packaging: Box; Datasheet URL: http://katalog.we-online.de/em/datasheet/6913137100xx.pdf; Pitch: 5.00mm

## Nets that join several sheets
GND: sch_station_de_charge (19 pins), sch_station_de_charge_r (C12.2 D9.2 D10.2 P1.2)